# EAGLE design untitled (EAGLE 9.1.1)
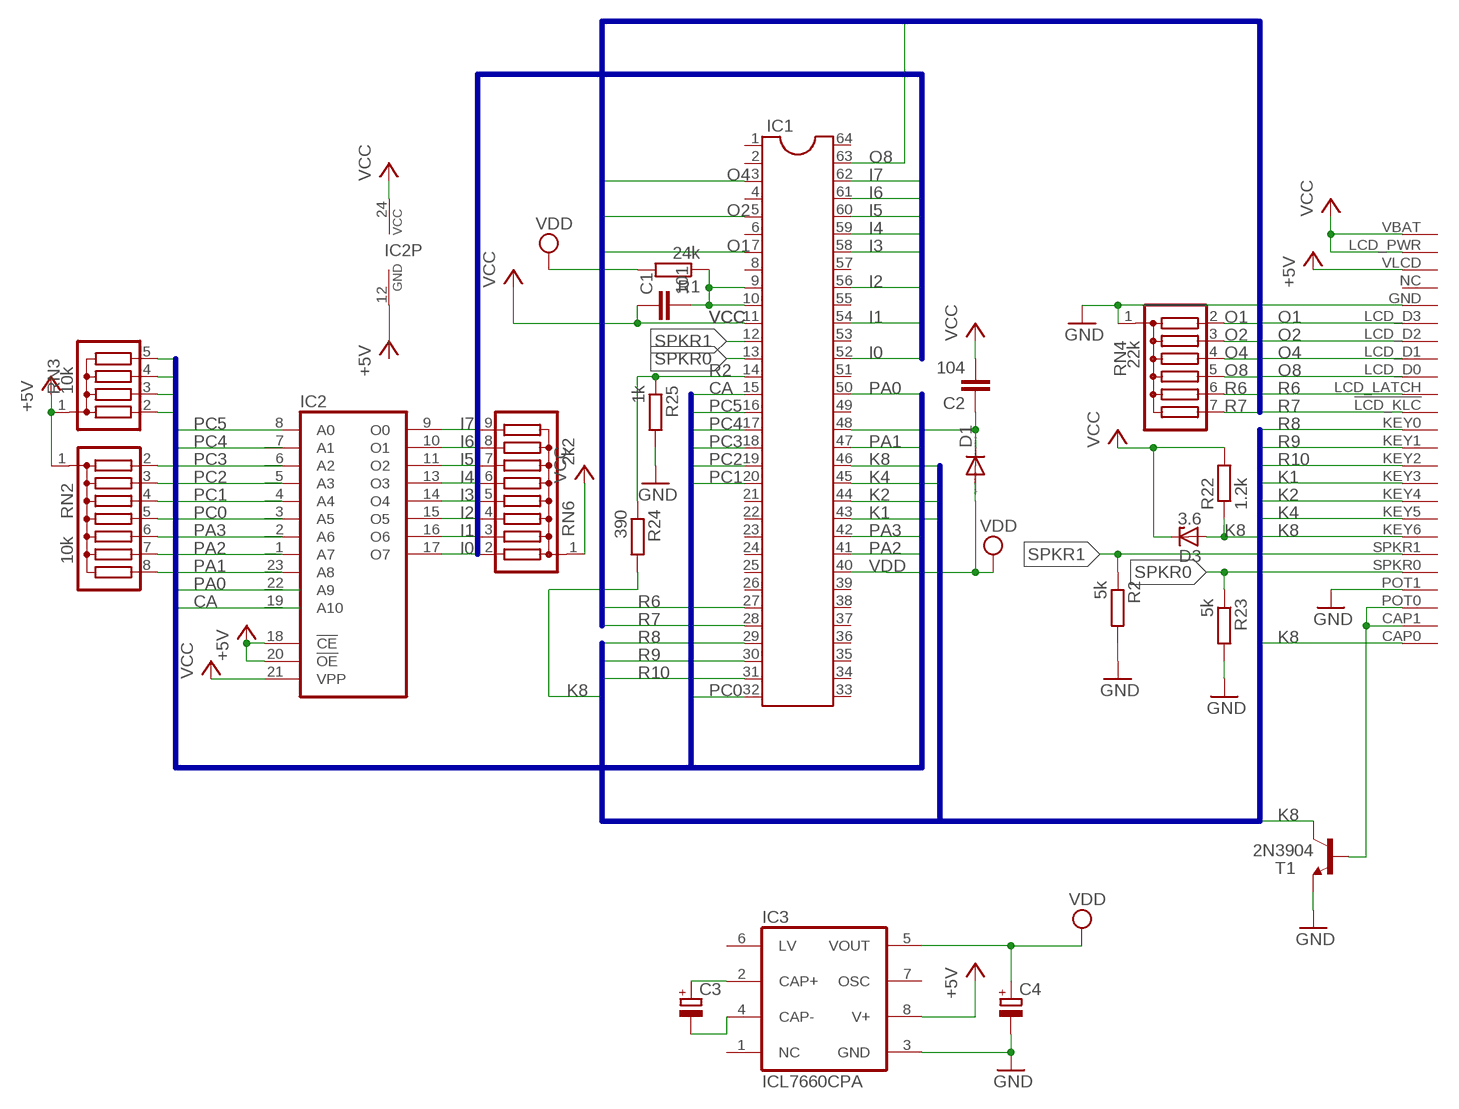
[diagram p0: schematic, sheet 1]

## Parts
C1  101  C-EU025-024X044  [C025-024X044]
C2  104  C-EU025-024X044  [C025-024X044]
C3  CPOL-EUE2.5-5  [E2,5-5]
C4  CPOL-EUE2.5-5  [E2,5-5]
D1  DIODE-D-5  [D-5]
D3  3.6  ZENER-DIODEZD-7.5  [ZDIO-7.5]
IC1  DIL64  [DIL64]
IC2  2716  [DIL24]
IC3  ICL7660CPA  [DIL08]
R1  24k  R-EU_0204/7  [0204/7]
R2  5k  R-EU_0204/7  [0204/7]
R22  1.2k  R-EU_0204/7  [0204/7]
R23  5k  R-EU_0204/7  [0204/7]
R24  390  R-EU_0207/10  [0207/10]
R25  1k  R-EU_0207/10  [0207/10]
RN2  10k  G07R  [SIL8]
RN3  10k  G04R  [SIL5]
RN4  22k  G06R  [SIL7]
RN6  2k2  G08R  [SIL9]
T1  2N3904  [TO92]
U$1  CONNECTOR  [CONNECTOR]

## Nets
+5V: IC2.12(GND) IC2.18(!CE) IC2.20(!OE) IC3.8(V+) RN2.1 RN3.1 U$1.VLCD
CA: IC1.15 IC2.19(A10) RN3.3
GND: C4.- IC3.3(GND) R2.2 R23.2 R25.2 RN4.1 T1.3(E) U$1.GND U$1.POT1
I0: IC1.52 IC2.17(O7) RN6.2
I1: IC1.54 IC2.16(O6) RN6.3
I2: IC1.56 IC2.15(O5) RN6.4
I3: IC1.58 IC2.14(O4) RN6.5
I4: IC1.59 IC2.13(O3) RN6.6
I5: IC1.60 IC2.11(O2) RN6.7
I6: IC1.61 IC2.10(O1) RN6.8
I7: IC1.62 IC2.9(O0) RN6.9
K1: IC1.43 U$1.KEY3
K2: IC1.44 U$1.KEY4
K4: IC1.45 U$1.KEY5
K8: D3.A IC1.46 R22.1 R24.2 T1.1(C) U$1.CAP0 U$1.KEY6
N$1: C2.1 D1.C IC1.48
N$2: C1.2 IC1.9 IC1.10 R1.1
N$3: T1.2(B) U$1.CAP1 U$1.POT0
N$4: C3.+ IC3.2(CAP+)
N$5: C3.- IC3.4(CAP-)
O1: IC1.7 RN4.2 U$1.LCD_D3
O2: IC1.5 RN4.3 U$1.LCD_D2
O4: IC1.3 RN4.4 U$1.LCD_D1
O8: IC1.63 RN4.5 U$1.LCD_D0
PA0: IC1.50 IC2.22(A9) RN3.2
PA1: IC1.47 IC2.23(A8) RN2.8
PA2: IC1.41 IC2.1(A7) RN2.7
PA3: IC1.42 IC2.2(A6) RN2.6
PC0: IC1.32 IC2.3(A5) RN2.5
PC1: IC1.20 IC2.4(A4) RN2.4
PC2: IC1.19 IC2.5(A3) RN2.3
PC3: IC1.18 IC2.6(A2) RN2.2
PC4: IC1.17 IC2.7(A1) RN3.4
PC5: IC1.16 IC2.8(A0) RN3.5
R2: IC1.14 R24.1 R25.1
R6: IC1.27 RN4.6 U$1.LCD_LATCH
R7: IC1.28 RN4.7 U$1.!LCD_KLC(LCD_CLK)
R8: IC1.29 U$1.KEY0
R9: IC1.30 U$1.KEY1
R10: IC1.31 U$1.KEY2
SPKR0: IC1.13 R23.1 U$1.SPKR0
SPKR1: IC1.12 R2.1 U$1.SPKR1
VCC: C1.1 C2.2 D3.C IC1.11 IC2.21(VPP) IC2.24(VCC) R22.2 RN6.1 U$1.LCD_PWR U$1.VBAT
VDD: C4.+ D1.A IC1.40 IC3.5(VOUT) R1.2
Unconnected: IC1.1 IC1.2 IC1.4 IC1.6 IC1.8 IC1.21 IC1.22 IC1.23 IC1.24 IC1.25 IC1.26 IC1.33 IC1.34 IC1.35 IC1.36 IC1.37 IC1.38 IC1.39 IC1.49 IC1.51 IC1.53 IC1.55 IC1.57 IC1.64 IC3.1(NC) IC3.6(LV) IC3.7(OSC) U$1.NC

## Buses
ADDR:CA,PA[0..3],PC[0..5]
DATA:I[0..7]
LCD:O1,O2,O4,O8,R6,R7
KEY:K1,K2,K4,K8,R8,R9,R10

## Library data of the parts
C1 C2 = resistor:C-EU: CAPACITOR, European symbol
C3 C4 = resistor:CPOL-EU: POLARIZED CAPACITOR, European symbol
D1 = diode:DIODE-: DIODE
D3 = diode:ZENER-DIODE: Z-Diode
IC1 = ic-package:DIL64: Dual In Line; SPICEPREFIX: X
IC2 = memory:2716: MEMORY
IC3 = maxim:ICL7660CPA: VOLTAGE CONVERTER; MF: INTERSIL; MPN: ICL7660CPA; OC_FARNELL: 1018170; OC_NEWARK: 06F7441
R1 R2 R22-R25 = resistor:R-EU_: RESISTOR, European symbol
RN2 = resistor-sil:G07R: SIL RESISTOR; OC_FARNELL: unknown; OC_NEWARK: unknown
RN3 = resistor-sil:G04R: SIL RESISTOR; OC_FARNELL: unknown; OC_NEWARK: unknown
RN4 = resistor-sil:G06R: SIL RESISTOR; OC_FARNELL: unknown; OC_NEWARK: unknown
RN6 = resistor-sil:G08R: SIL RESISTOR; OC_FARNELL: unknown; OC_NEWARK: unknown
T1 = transistor:2N3904: NPN TRANSISTOR
U$1 = microvisionConnector:CONNECTOR

## Board
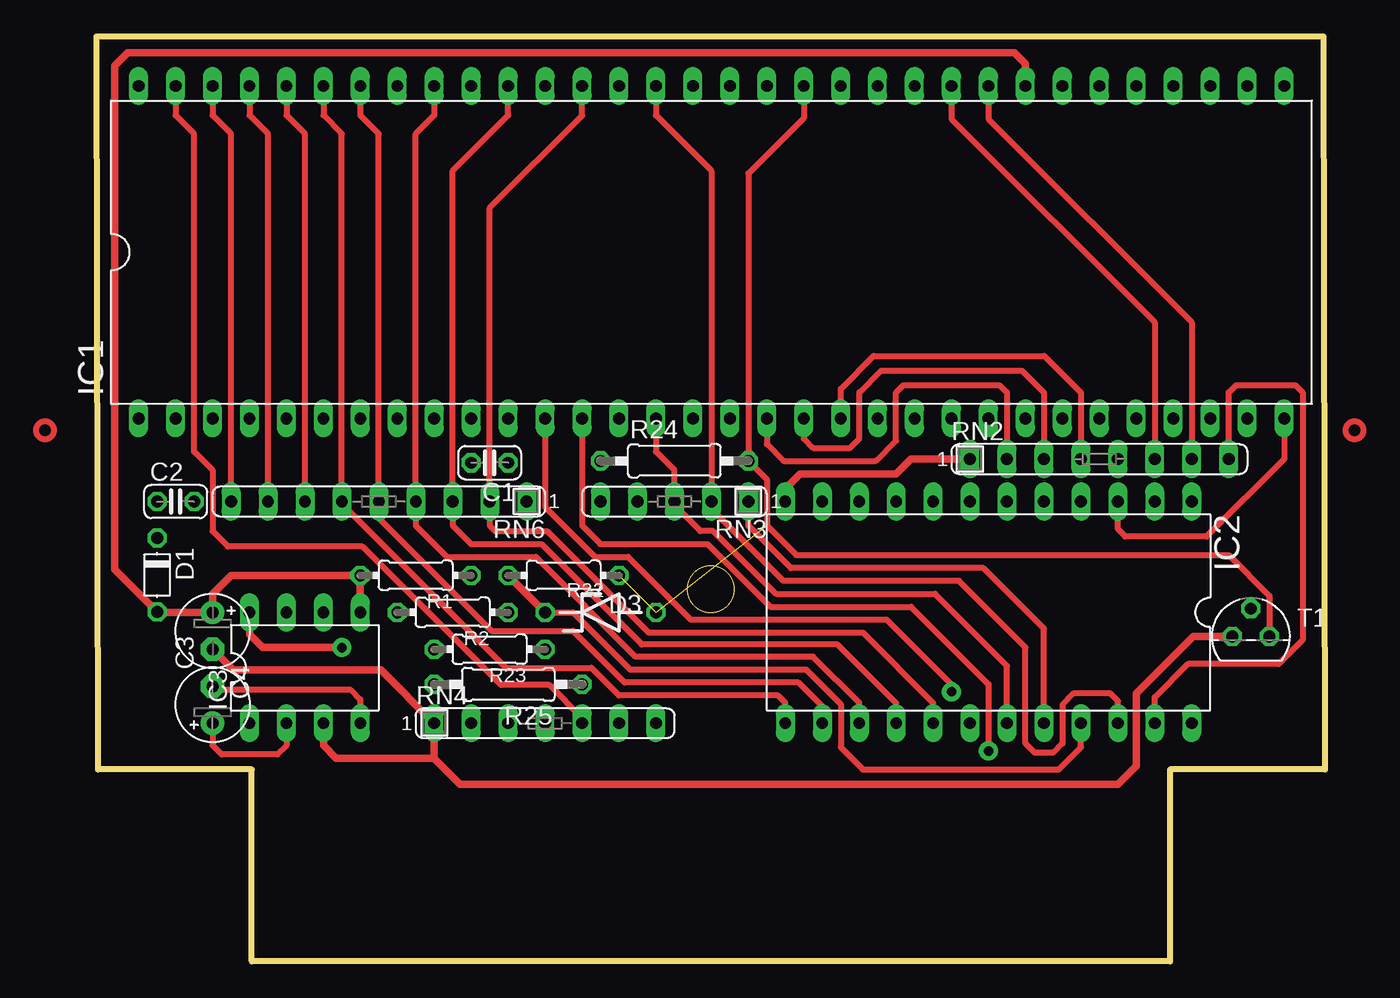
[diagram p1: board, top side]
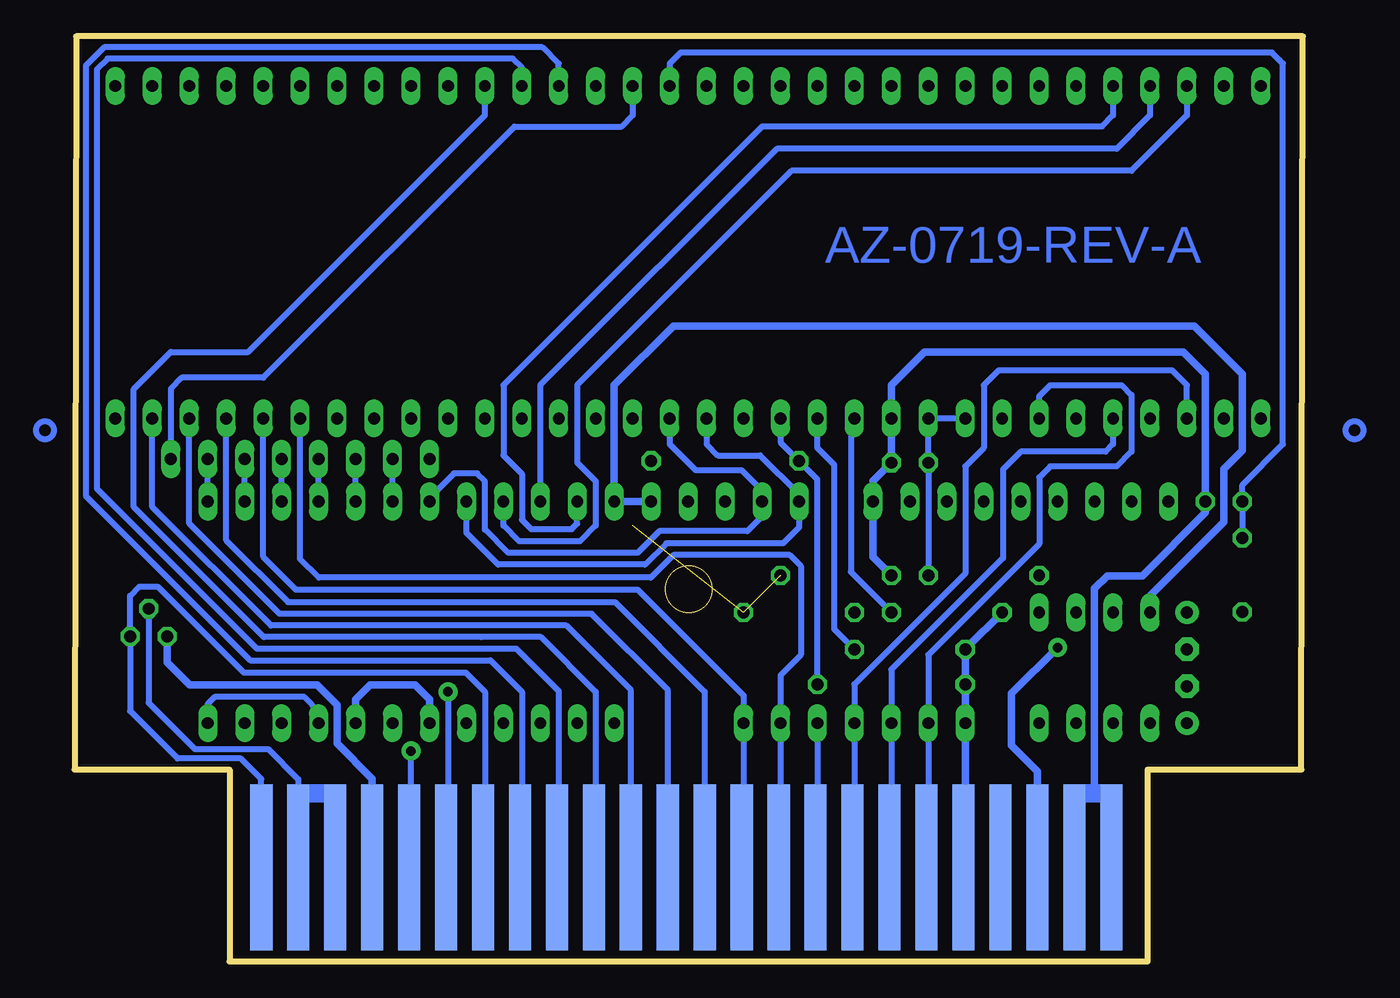
[diagram p2: board, bottom side, seen from below]

Size 84.43 x 63.6 mm. Coordinates in mm from the lower left corner, seen from the top.
Outline: 73.79,13.21 73.79,0 10.67,0 10.67,13.21 0.1,13.21 0,63.6 84.33,63.6 84.43,13.21 73.79,13.21
Outline: circle at 42.23,25.59 radius 1.6
Copper layers (1*16): Top 0.035mm / dielectric 1.5mm / Bottom 0.035mm
Design rules "default *": minimum track width 12mil, minimum drill 0.35mm, track to track 6mil, track to pad 6mil, pad to pad 6mil, via to via 6mil, smd to smd 6mil, copper to edge 8mil, drill to drill 6mil, minimum pad ring 10mil, minimum via ring 8mil, stop-mask expansion 4mil, vias tented up to drill 0mil, thermal gap 10mil

### Footprints (pad centres in the part's own frame; a part is rotated, then mirrored left to right if it is on the bottom)
C025-024X044 = drill 0.813 octagon: 1 -1.27,0; 2 1.27,0
E2,5-5 = drill 0.813 pad 1.6: + -1.27,0 | drill 0.813 pad 1.6 octagon: - 1.27,0
D-5 = drill 0.813 octagon: A 2.54,0; C -2.54,0
ZDIO-7.5 = drill 0.813 octagon: A 3.81,0; C -3.81,0
DIL64 = drill 0.813 long: 1 -39.37,-11.43; 2 -36.83,-11.43; 3 -34.29,-11.43; 4 -31.75,-11.43; 5 -29.21,-11.43; 6 -26.67,-11.43; 7 -24.13,-11.43; 8 -21.59,-11.43; 9 -19.05,-11.43; 10 -16.51,-11.43; 11 -13.97,-11.43; 12 -11.43,-11.43; 13 -8.89,-11.43; 14 -6.35,-11.43; 15 -3.81,-11.43; 16 -1.27,-11.43; 17 1.27,-11.43; 18 3.81,-11.43; 19 6.35,-11.43; 20 8.89,-11.43; 21 11.43,-11.43; 22 13.97,-11.43; 23 16.51,-11.43; 24 19.05,-11.43; 25 21.59,-11.43; 26 24.13,-11.43; 27 26.67,-11.43; 28 29.21,-11.43; 29 31.75,-11.43; 30 34.29,-11.43; 31 36.83,-11.43; 32 39.37,-11.43; 33 39.37,11.43; 34 36.83,11.43; 35 34.29,11.43; 36 31.75,11.43; 37 29.21,11.43; 38 26.67,11.43; 39 24.13,11.43; 40 21.59,11.43; 41 19.05,11.43; 42 16.51,11.43; 43 13.97,11.43; 44 11.43,11.43; 45 8.89,11.43; 46 6.35,11.43; 47 3.81,11.43; 48 1.27,11.43; 49 -1.27,11.43; 50 -3.81,11.43; 51 -6.35,11.43; 52 -8.89,11.43; 53 -11.43,11.43; 54 -13.97,11.43; 55 -16.51,11.43; 56 -19.05,11.43; 57 -21.59,11.43; 58 -24.13,11.43; 59 -26.67,11.43; 60 -29.21,11.43; 61 -31.75,11.43; 62 -34.29,11.43; 63 -36.83,11.43; 64 -39.37,11.43
DIL24 = drill 0.813 long: 1 -13.97,-7.62; 2 -11.43,-7.62; 3 -8.89,-7.62; 4 -6.35,-7.62; 5 -3.81,-7.62; 6 -1.27,-7.62; 7 1.27,-7.62; 8 3.81,-7.62; 9 6.35,-7.62; 10 8.89,-7.62; 11 11.43,-7.62; 12 13.97,-7.62; 13 13.97,7.62; 14 11.43,7.62; 15 8.89,7.62; 16 6.35,7.62; 17 3.81,7.62; 18 1.27,7.62; 19 -1.27,7.62; 20 -3.81,7.62; 21 -6.35,7.62; 22 -8.89,7.62; 23 -11.43,7.62; 24 -13.97,7.62
DIL08 = drill 0.813 long: 1 -3.81,-3.81; 2 -1.27,-3.81; 3 1.27,-3.81; 4 3.81,-3.81; 5 3.81,3.81; 6 1.27,3.81; 7 -1.27,3.81; 8 -3.81,3.81
0204/7 = drill 0.813 octagon: 1 -3.81,0; 2 3.81,0
0207/10 = drill 0.813 octagon: 1 -5.08,0; 2 5.08,0
SIL8 = drill 0.813 long: 1 -8.89,0; 2 -6.35,0; 3 -3.81,0; 4 -1.27,0; 5 1.27,0; 6 3.81,0; 7 6.35,0; 8 8.89,0
SIL5 = drill 0.813 long: 1 -5.08,0; 2 -2.54,0; 3 0,0; 4 2.54,0; 5 5.08,0
SIL7 = drill 0.813 long: 1 -7.62,0; 2 -5.08,0; 3 -2.54,0; 4 0,0; 5 2.54,0; 6 5.08,0; 7 7.62,0
SIL9 = drill 0.813 long: 1 -10.16,0; 2 -7.62,0; 3 -5.08,0; 4 -2.54,0; 5 0,0; 6 2.54,0; 7 5.08,0; 8 7.62,0; 9 10.16,0
TO92 = drill 0.813 octagon: 1 1.27,0; 2 0,1.905; 3 -1.27,0
CONNECTOR = smd 1.524 x 11.43: !LCD_KLC 5.08,-2.54; CAP0 -27.94,-2.54; CAP1 -25.4,-2.54; GND 20.32,-2.54; KEY0 2.54,-2.54; KEY1 0,-2.54; KEY2 -2.54,-2.54; KEY3 -5.08,-2.54; KEY4 -7.62,-2.54; KEY5 -10.16,-2.54; KEY6 -12.7,-2.54; LCD_D0 10.16,-2.54; LCD_D1 12.7,-2.54; LCD_D2 15.24,-2.54; LCD_D3 17.78,-2.54; LCD_LATCH 7.62,-2.54; LCD_PWR 27.94,-2.54; NC 22.86,-2.54; POT0 -22.86,-2.54; POT1 -20.32,-2.54; SPKR0 -17.78,-2.54; SPKR1 -15.24,-2.54; VBAT 30.48,-2.54; VLCD 25.4,-2.54

### Placement (x,y rotation side)
C1  27.03,34.29 180 top
C2  5.44,31.62 0 top
C3  7.98,17.65 90 top
C4  7.98,22.73 270 top
D1  4.17,26.57 270 top
D3  34.65,24 0 top
IC1  42.27,48.77 0 top
IC2  61.32,24 180 top
IC3  14.33,20.19 0 top
R1  21.95,26.54 180 top
R2  24.49,24 180 top
R22  32.11,26.54 180 top
R23  27.03,21.46 180 top
R24  39.73,34.42 0 top
R25  28.3,19.05 180 top
RN2  68.94,34.54 0 top
RN3  39.73,31.62 180 top
RN4  30.84,16.38 0 top
RN6  19.41,31.62 180 top
T1  79.35,22.35 0 top
U$1  43.66,9.02 0 bottom

### Tracks (layer width: path | path; a pad name or v marks a point on that pad's centre or on a via)
+5V  (via drill 0.65 pad 1.3)
  Top 0.406: 47.35,32.51 IC2.12 | IC2.20 65.13,22.89 60.96,27.05 47.73,27.05 44.81,29.97 RN3.1
  Top 0.508: RN2.1 55.98,34.54 54.97,33.53 48.36,33.53 47.35,32.51 | IC3.8 10.52,22.48 11.4,21.59 v16.87,21.59
  Bottom 0.508: IC2.18 60.05,18.03 61.04,19.03 64.13,19.03 65.13,18.03 IC2.20 | RN3.1 IC2.12 47.35,39.62 43.28,43.69 7.47,43.69 4.17,40.39 4.17,35.14 5.44,33.87 5.44,30.23 10.52,25.15 IC3.8 | U$1.VLCD 18.26,13.08 20.04,14.86 20.04,18.42 v16.87,21.59
CA
  Top 0.406: IC1.15 38.46,35.05 39.73,33.78 RN3.3 39.73,31.37 41.5,29.59 42.39,29.59 46.71,25.27 57.63,25.27 62.59,20.32 IC2.19
GND
  Top 0.508: C4.- 9.4,20.04 19.56,20.04 RN4.1 23.22,13.97 | T1.3 75.38,22.35 71.48,18.44 71.48,13.46 70.21,12.19 24.99,12.19 23.22,13.97 | IC3.3 15.6,14.86 16.48,13.97 23.22,13.97
  Bottom 0.305: R23.2 23.09,21.59 | 22.71,6.35 22.83,6.48 U$1.GND 23.22,6.6
  Bottom 0.508: U$1.POT1 63.98,12.57 66.4,14.99 66.4,17.65 67.77,19.03 76.53,19.03 78.08,20.57 T1.3 | R2.2 23.09,21.59 | R23.2 R25.2 RN4.1 23.22,6.6
I0
  Top 0.406: IC2.17 57.51,17.77 52.67,22.61 37.95,22.61 30.96,29.59 27.41,29.59 27.03,29.97 RN6.2 27.03,51.81 33.38,58.16 IC1.52
I1
  Top 0.406: IC2.16 54.97,17.77 50.95,21.79 37.49,21.79 30.58,28.7 25.76,28.7 24.49,29.97 RN6.3 24.49,54.36 28.3,58.17 IC1.54
I2
  Top 0.406: IC2.15 52.43,17.78 49.25,20.96 37.06,20.96 30.2,27.81 24.1,27.81 21.95,29.97 RN6.4 21.95,56.9 23.22,58.17 IC1.56
I3
  Top 0.406: IC2.14 49.89,17.53 48.23,19.18 36.3,19.18 32.74,22.73 27.15,22.73 19.41,30.48 RN6.5 19.41,56.9 18.14,58.17 IC1.58
I4
  Top 0.406: IC2.13 47.35,17.78 46.84,18.29 35.92,18.29 34.01,20.19 28.17,20.19 16.87,31.5 RN6.6 16.87,56.9 15.6,58.17 IC1.59
I5
  Top 0.406: IC1.60 13.06,58.17 14.33,56.9 RN6.7
  Bottom 0.406: IC1.60 13.06,58.17 13.82,57.4 37.19,57.4 54.97,39.62 54.97,34.8 53.7,33.53 53.7,30.35 53.06,29.72 50.27,29.72 49.89,30.1 IC2.11
I6
  Top 0.406: IC1.61 10.52,58.17 11.79,56.9 RN6.8
  Bottom 0.406: IC1.61 10.52,58.17 12.8,55.88 36.17,55.88 52.43,39.62 IC2.10
I7
  Top 0.406: IC1.62 7.98,58.17 9.25,56.9 RN6.9
  Bottom 0.406: IC2.9 54.97,29.97 53.87,28.88 49.71,28.88 48.62,29.97 48.62,33.02 49.89,34.29 49.89,39.62 35.15,54.36 11.79,54.36 7.98,58.17 IC1.62
K1
  Bottom 0.406: U$1.KEY3 48.62,6.6 48.62,18.54 52.37,22.3 56.49,22.3 71.44,22.3 80.37,31.23 80.37,39.37 77.83,41.91 72.49,41.91 56.24,58.17 IC1.43
K2
  Bottom 0.406: 51.16,6.6 51.16,4.83 | IC1.44 53.7,61.47 54.31,62.08 82.16,62.08 82.91,61.33 82.91,32.5 71.92,21.51 54.08,21.51 51.16,18.59 51.16,6.6 | 51.16,6.6 U$1.KEY4
K4
  Bottom 0.406: IC1.45 51.16,61.72 52.27,62.84 82.42,62.84 83.67,61.59 83.67,32 72.36,20.7 55.85,20.7 53.7,18.54 53.7,6.6 U$1.KEY5
K8  (2 unrouted)
  Top 0.406: IC1.46 48.62,57.98 44.81,54.17 R24.2 46.08,33.15 46.08,29.97 48.11,27.94 77.83,27.94 80.62,25.15 T1.1
  Bottom 0.406: U$1.KEY6 56.24,6.6 56.24,18.54 57.56,19.86 72.81,19.86 78.73,25.78 79.98,25.78 80.62,25.15 T1.1 80.62,17.21 77.37,13.96 73.02,13.96 71.6,12.54 U$1.CAP0
N$1
  Bottom 0.406: D1.C C2.1 4.17,32.77 1.37,35.56 1.37,61.72 1.63,61.98 2.13,62.48 42.77,62.48 43.54,61.72 IC1.48
N$2
  Bottom 0.406: R1.1 C1.2 IC1.10 IC1.9
N$3
  Bottom 0.305: U$1.POT0 66.52,11.51 66.57,11.56
  Bottom 0.406: U$1.CAP1 69.06,11.56 69.06,12.52 71.15,14.61 76.17,14.61 79.35,17.78 T1.2
  Bottom 1.27: 66.57,11.56 69.06,11.56
N$4
  Top 0.406: C3.+ 7.98,14.86 8.61,14.22 12.42,14.22 13.06,14.86 IC3.2
N$5
  Top 0.406: IC3.4 18.14,18.03 17.5,18.67 8.23,18.67 C3.-
O1
  Bottom 0.406: IC1.7 18.14,38.86 17.37,39.62 12.46,39.62 11.79,38.95 11.79,35.05 12.8,34.04 17.37,34.04 18.14,33.27 18.14,28.7 25.76,21.08 RN4.2 25.76,6.6 U$1.LCD_D3
O2
  Bottom 0.406: IC1.5 13.06,35.56 13.56,35.05 19.41,35.05 20.62,33.83 20.62,27.74 28.3,20.07 RN4.3 28.3,6.6 U$1.LCD_D2
O4
  Bottom 0.406: IC1.3 7.98,39.62 8.99,40.64 20.93,40.64 21.95,39.62 21.95,35.31 23.22,34.04 23.22,26.67 30.84,19.05 RN4.4 30.84,6.6 U$1.LCD_D1
O8
  Top 0.406: IC1.63 5.44,58.17 6.71,56.9 6.71,35.05 7.98,33.78 7.98,29.6 9.04,28.53 18.28,28.53 27.81,19 31.14,19 33.38,16.76 RN4.5
  Bottom 0.406: RN4.5 33.38,6.6 U$1.LCD_D0
PA0
  Top 0.406: IC1.50 38.46,58.17 42.27,54.36 RN3.2 42.27,31.11 47.22,26.16 59.28,26.16 63.86,21.59 63.86,14.99 64.49,14.35 65.76,14.35 66.4,14.99 66.4,17.65 67.16,18.42 69.7,18.42 70.21,17.91 IC2.22
PA1
  Top 0.406: RN2.8 77.83,39.12 78.33,39.62 82.41,39.61 82.91,39.12 82.91,22.1 81.25,20.45 75.03,20.45 72.75,18.16 IC2.23
  Bottom 0.406: IC1.47 46.08,58.17 46.84,57.4 54.2,57.4 71.48,40.13 77.06,40.13 77.83,39.37 RN2.8
PA2
  Top 0.406: RN2.7 75.29,43.94 61.32,57.91 IC1.41
  Bottom 0.406: IC2.1 RN2.7
PA3
  Top 0.406: RN2.6 72.75,43.94 58.78,57.91 IC1.42
  Bottom 0.406: IC2.2 RN2.6
PC0
  Top 0.406: IC1.32 81.64,34.54 76.3,29.21 70.71,29.21 70.21,29.72 IC2.3
  Bottom 0.406: IC2.3 RN2.5
PC1
  Top 0.406: IC1.20 51.16,39.37 53.42,41.63 65.14,41.63 67.67,39.11 RN2.4
  Bottom 0.406: IC2.4 RN2.4
PC2
  Top 0.406: RN2.3 65.13,39.11 63.62,40.62 53.93,40.62 52.43,39.12 52.43,35.94 51.79,35.31 49.25,35.31 48.62,35.94 IC1.19
  Bottom 0.406: IC2.5 RN2.3
PC3
  Top 0.406: RN2.2 62.59,34.77 62.58,34.77 62.58,39.12 62.08,39.62 55.47,39.62 54.97,39.12 54.97,35.81 53.57,34.42 47.22,34.42 46.08,35.56 IC1.18
  Bottom 0.406: IC2.6 RN2.2
PC4
  Bottom 0.406: IC2.7 60.05,31.88 58.37,33.55 56.77,33.55 56.24,33.02 56.24,29.69 54.64,28.09 45.73,28.09 44.23,29.59 38.2,29.59 37.19,30.61 RN3.4 37.19,32.39 38.58,33.78 41.76,33.78 43.54,35.56 IC1.17
PC5
  Bottom 0.406: IC2.8 57.51,29.46 55.32,27.28 45.24,27.28 43.77,28.75 35.74,28.75 34.65,29.85 RN3.5 34.65,32.13 37.31,34.8 40.23,34.8 41,35.56 IC1.16
R2
  Bottom 0.406: R25.1 33.38,33.15 R24.1 35.92,35.69 IC1.14
R6
  Bottom 0.406: IC1.27 68.94,27.69 67.64,26.39 44.83,26.39 43.28,27.94 35.28,27.94 34.52,27.18 34.52,21.08 35.92,19.68 RN4.6 35.92,6.6 U$1.LCD_LATCH
R7
  Bottom 0.406: IC1.28 71.48,27.81 69.21,25.55 45.72,25.55 38.46,18.29 RN4.7 38.46,6.6 U$1.!LCD_KLC
R8
  Bottom 0.406: IC1.29 74.02,28.96 69.77,24.71 47.29,24.71 41.12,18.54 U$1.KEY0 41,6.6
R9
  Bottom 0.406: U$1.KEY1 43.66,18.67 48.89,23.9 70.36,23.9 76.56,30.1 IC1.30
R10
  Bottom 0.406: U$1.KEY2 46.2,18.67 50.62,23.09 70.94,23.09 79.1,31.24 IC1.31
SPKR0  (via drill 0.65 pad 1.3)
  Top 0.406: v61.32,14.48 61.32,19.05 55.98,24.38 46.33,24.38 42.01,28.7 34.65,28.7 33.38,29.97 IC1.13
  Bottom 0.406: IC1.13 33.38,35.31 32.23,34.16 32.23,22.86 R23.1 | v61.32,14.48 61.32,5.59 61.44,5.71 U$1.SPKR0
SPKR1  (via drill 0.65 pad 1.3)
  Top 0.406: v58.78,18.54 58.78,19.05 54.33,23.5 40.87,23.5 36.55,27.81 34.26,27.81 30.84,31.24 IC1.12
  Bottom 0.406: IC1.12 31.09,37.08 31.09,26.8 R2.1 | v58.78,18.54 58.78,6.6 U$1.SPKR1
VCC
  Top 0.406: D3.C 32.74,24 36.68,20.07 48.77,20.07 51.16,17.68 51.16,14.73 52.68,13.21 66.14,13.21 67.67,14.73 IC2.21
  Top 0.508: D3.C R22.2
  Bottom 0.305: U$1.LCD_PWR 15.72,11.56 | 13.18,11.56 U$1.VBAT | 28.3,37.08 IC1.11
  Bottom 0.406: IC2.21 67.67,17.21 68.64,18.19 74.82,18.19 75.29,17.72 IC2.24
  Bottom 0.508: R22.2 29.57,27.81 RN6.1 29.57,33.02 C1.1 28.3,37.08 28.3,39.62 26.01,41.91 8.23,41.91 6.71,40.39 C2.2 6.71,30.86 11.05,26.52 13.46,26.52 14.33,25.65 14.33,11.56
  Bottom 1.27: 15.72,11.56 14.33,11.56 13.18,11.56
VDD
  Top 0.508: IC1.40 63.86,61.72 63.09,62.48 2.13,62.48 1.24,61.59 1.24,26.95 D1.A 4.19,24 C4.+ 7.98,25.27 9.25,26.54 R1.2 | R1.2 | R1.2 IC3.5
(copper drawn outside any net)
  shapes: Bottom circle x2, Top circle x2

### Text on the board
Bottom: AZ-0719-REV-A